# Altium schematic sheet MAIN.SchDoc
size 420 x 297 mm; Address1: Address1; Address2: Address2; Address3: Address3; Address4: Address4; SheetNumber: 1; SheetTotal: 2; Разраб.: Шкляев; Обозначение документа: ВРГД.468332.001 Э3; Пров.: Абрамов; Н.контр.: Ермакова; Утв.: Солдатченков; Наименование организации: АО "Вектор развития"; Перв. применение: ВРГД.468332.001; Наименование изделия 1: Плата; Наименование изделия 2: Схема электрическая; Наименование изделия 3: принципиальная; Нач. отд.: Нач. отд.; Фамилия нач. отд.: Кононенко; Наименование изделия 4: КОСВТ-1
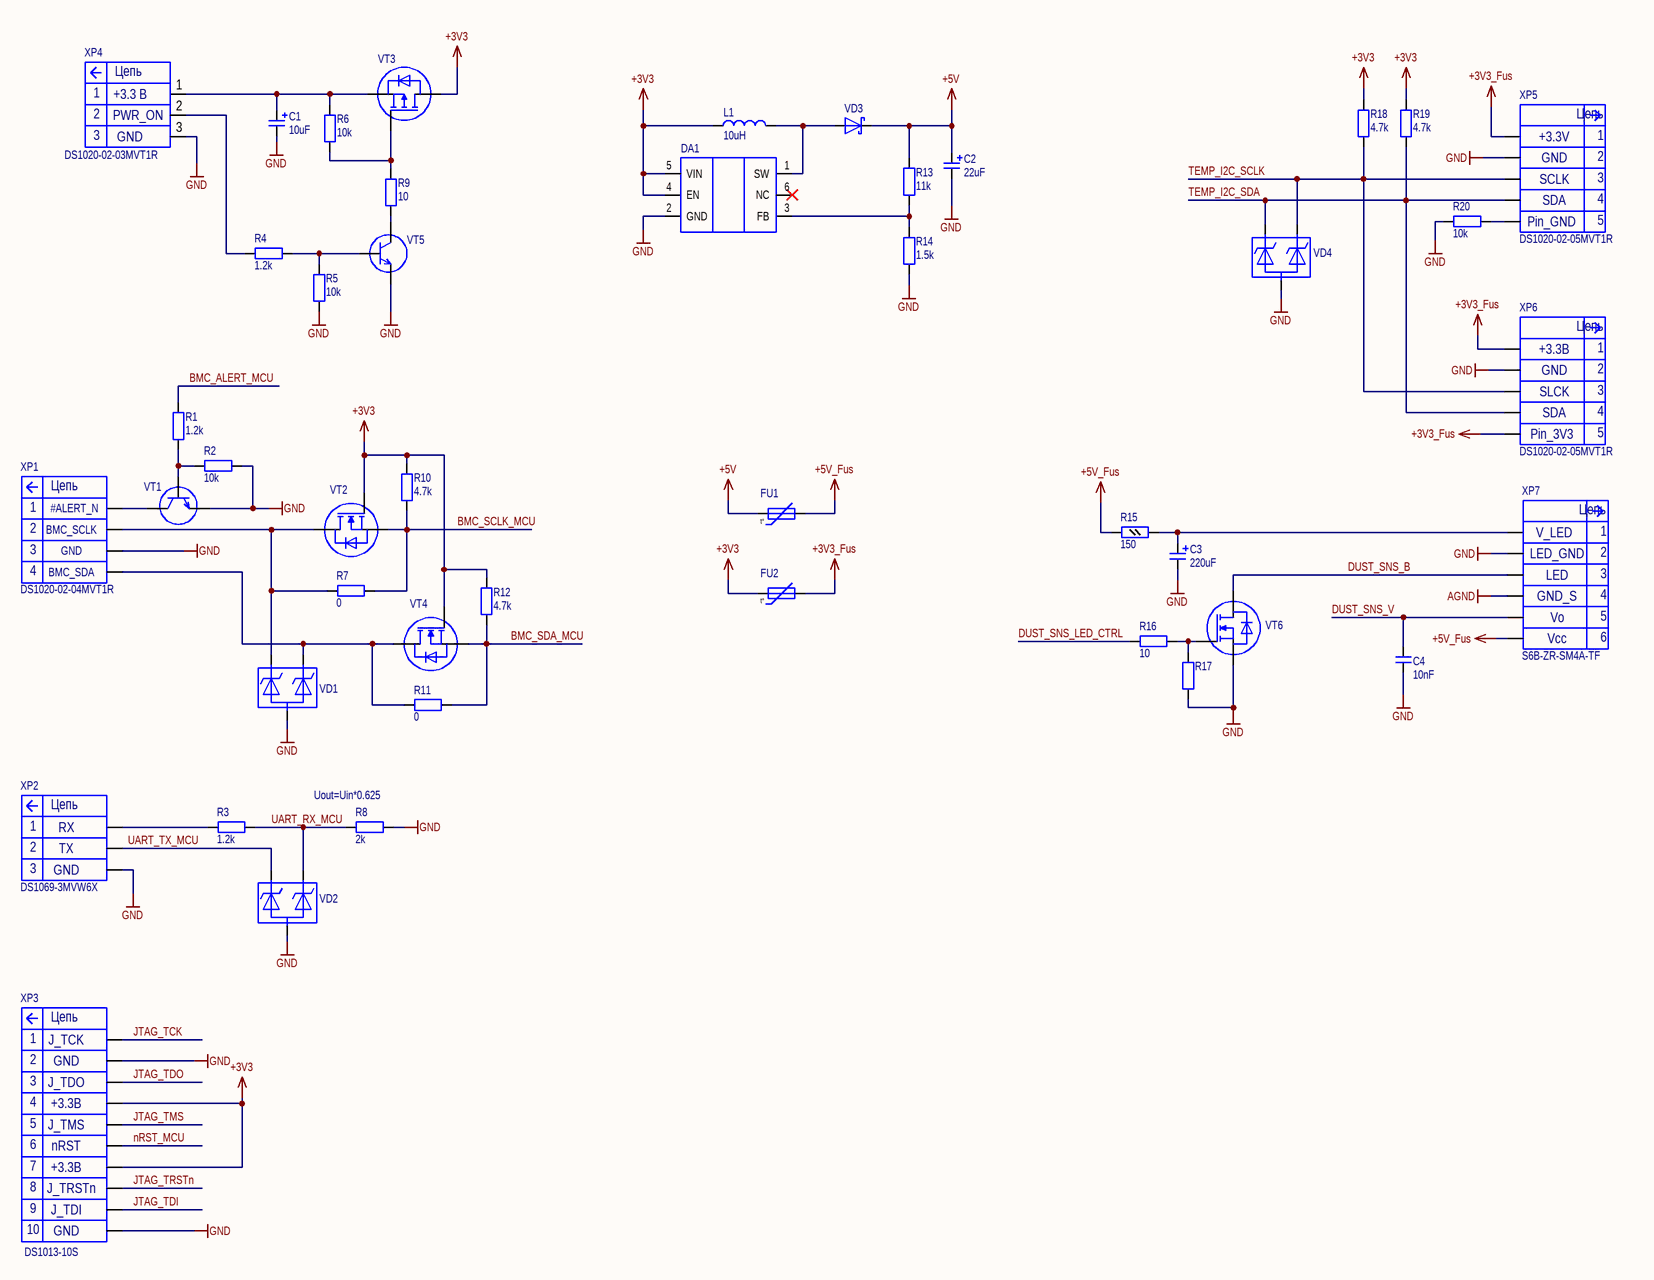
[diagram p0: MAIN.SchDoc]

## Parts
C1  10uF  [CAP ALSMD ELEC 4.3MM H5.4MM]
C2  22uF  [CAP ALSMD ELEC 4.3MM H5.4MM]
C3  220uF  [CAP ALSMD ELEC 6.6MM H7.7MM]
C4  10nF  [CAP 0603_1608]
DA1  MT3608 AEROSEMI  [TI SOT-23-6 DBV]  (value not drawn)
FU1  BSMD0603-010-15V BHFUSE  [FUSE 0603_1608 0.8MM]  (value not drawn)
FU2  BSMD0603-010-15V BHFUSE  [FUSE 0603_1608 0.8MM]  (value not drawn)
L1  10uH  [MURATA LQH32CN]
R1  1.2k  [RES 0603_1608]
R2  10k  [RES 0603_1608]
R3  1.2k  [RES 0603_1608]
R4  1.2k  [RES 0603_1608]
R5  10k  [RES 0603_1608]
R6  10k  [RES 0603_1608]
R7  0  [RES 0603_1608]
R8  2k  [RES 0603_1608]
R9  10  [RES 0603_1608]
R10  4.7k  [RES 0603_1608]
R11  0  [RES 0603_1608]
R12  4.7k  [RES 0603_1608]
R13  11k  [RES 0603_1608]
R14  1.5k  [RES 0603_1608]
R15  150  [RES 0805_2012]
R16  10  [RES 0603_1608]
R17  (no value)  [RES 0603_1608]
R18  4.7k  [RES 0603_1608]
R19  4.7k  [RES 0603_1608]
R20  10k  [RES 0603_1608]
VD1  PESD5V0U1UT  [SOT-23-3 N]  (value not drawn)
VD2  PESD5V0U1UT  [SOT-23-3 N]  (value not drawn)
VD3  1N5817WS Hottech  [MCC SOD-323]  (value not drawn)
VD4  PESD5V0U1UT  [SOT-23-3 N]  (value not drawn)
VT1  КТ229Б9  [SOT-23-3 N]  (value not drawn)
VT2  КП526А9  [SOT-23-3 N]  (value not drawn)
VT3  AO3401 Hottech  [SOT-23-3 N]  (value not drawn)
VT4  КП526А9  [SOT-23-3 N]  (value not drawn)
VT5  КТ229Б9  [SOT-23-3 N]  (value not drawn)
VT6  КП526А9  [SOT-23-3 N]  (value not drawn)
XP1  DS1020-02-04MVT1R  Net_4: BMC_SDA  Net_3: GND  Net_2: BMC_SCLK  Net_1: #ALERT_N  [DS1020-02-04MVT1R]
XP2  DS1069-3MVW6X  Net_3: GND  Net_1: RX  Net_2: TX  [CONNFLY_DS1069-3M]
XP3  DS1013-10S  Net_10: GND  Net_9: J_TDI  Net_8: J_TRSTn  Net_7: +3.3В  Net_6: nRST  Net_5: J_TMS  Net_3: J_TDO  Net_1: J_TCK  [DS1013-10S]
XP4  DS1020-02-03MVT1R  Net_3: GND  Net_1: +3.3 В  Net_2: PWR_ON  [DS1020-02-03MVT1R]
XP5  DS1020-02-05MVT1R  Net_5: Pin_GND  Net_4: SDA  Net_3: SCLK  Net_2: GND  Net_1: +3.3V  [DS1020-02-05MVT1R]
XP6  DS1020-02-05MVT1R  Net_5: Pin_3V3  Net_4: SDA  Net_3: SLCK  Net_2: GND  Net_1: +3.3В  [DS1020-02-05MVT1R]
XP7  S6B-ZR-SM4A-TF  Net_6: Vcc  Net_5: Vo  Net_4: GND_S  Net_3: LED  Net_2: LED_GND  Net_1: V_LED  [JST S6B-ZR-SM4A-TF]

## Nets
+3V3: DA1.4(EN) DA1.5(VIN) FU2.1 L1.1(P) R10.2 R12.2 R18.2 R19.2 VT2.1(G) VT3.3(D) VT4.1(G) XP3.4 XP3.7
+3V3_Fus: FU2.2 XP5.1 XP6.1 XP6.5
+5V: C2.1(P) FU1.1 R13.2 VD3.2(C)
+5V_Fus: FU1.2 R15.1 XP7.6
AGND: XP7.4
GND: C1.2(N) C2.2(N) C3.2(N) C4.1 DA1.2(GND) R2.1 R5.1 R8.2 R14.1 R17.1 R20.2 VD1.3(A) VD2.3(A) VD4.3(A) VT1.2(E) VT5.2(E) VT6.2(S) XP1.3 XP2.3 XP3.2 XP3.10 XP4.3 XP5.2 XP6.2 XP7.2
BMC_ALERT_MCU: R1.2
BMC_SCLK_MCU: R7.1 R10.1 VT2.2(S)
BMC_SDA_MCU: R11.1 R12.1 VT4.2(S)
DUST_SNS_B: VT6.3(D) XP7.3
DUST_SNS_LED_CTRL: R16.1
DUST_SNS_V: C4.2 XP7.5
JTAG_TCK: XP3.1
JTAG_TDI: XP3.9
JTAG_TDO: XP3.3
JTAG_TMS: XP3.5
JTAG_TRSTn: XP3.8
nRST_MCU: XP3.6
TEMP_I2C_SCLK: R18.1 VD4.2(C2) XP5.3 XP6.3
TEMP_I2C_SDA: R19.1 VD4.1(C1) XP5.4 XP6.4
UART_RX_MCU: R3.2 R8.1 VD2.2(C2)
UART_TX_MCU: VD2.1(C1) XP2.2
NetC1_1: C1.1(P) R6.2 VT3.2(S) XP4.1
NetC3_1: C3.1(P) R15.2 XP7.1
NetDA1_1: DA1.1(SW) L1.2(N) VD3.1(A)
NetDA1_3: DA1.3(FB) R13.1 R14.2
NetR1_1: R1.1 R2.2 VT1.1(B)
NetR3_1: R3.1 XP2.1
NetR4_1: R4.1 XP4.2
NetR4_2: R4.2 R5.2 VT5.1(B)
NetR6_1: R6.1 R9.1 VT3.1(G)
NetR7_2: R7.2 VD1.1(C1) VT2.3(D) XP1.2
NetR9_2: R9.2 VT5.3(C)
NetR11_2: R11.2 VD1.2(C2) VT4.3(D) XP1.4
NetR16_2: R16.2 R17.2 VT6.1(G)
NetR20_1: R20.1 XP5.5
NetVT1_3: VT1.3(C) XP1.1

Not connected (* = marked no-connect by the designer): DA1 6(NC)*

## Notes on the sheet
- (near R8) Uout=Uin*0.625
- Перв. примен.
- Справ. №
- Подп. и дата
- Инв. № дубл.
- Взам. инв. №
- Разраб.
- Изм.
- Лист
- № докум.
- Подп.
- Дата
- Лит.
- Масса
- Масштаб
- Пров.
- Листов
- Инв. № подл.
- Утв.
- Н.контр.
- Копировал
- Формат А3
- (in symbol BSMD0603-010-15V BHFUSE) t°
- (in symbol DS1013-10S) Цепь
- (in symbol DS1020-02-03MVT1R) Цепь
- (in symbol DS1020-02-04MVT1R) Цепь
- (in symbol DS1020-02-05MVT1R) Цепь
- (in symbol DS1069-3MVW6X) Цепь
- (in symbol S6B-ZR-SM4A-TF) Цепь

## Library data of the parts
C1 = К50-97 – 25В – 10мкФ (±20) % – ЕВАЯ.673541.054ТУ: Конденсатор К50-97 – 25В – 10мкФ (±20) % – ЕВАЯ.673541.054ТУ; Manufacturer: АО Элеконд; Group: Конденсаторы полярные; Type: Конденсатор электролитический; Tolerance: ± 20%; Dielectric type: Electrolytic; Voltage: 25V; Manufacturer Part Number: К50-97 – 25В – 10мкФ (±20) % – ЕВАЯ.673541.054ТУ; Name: К50-97 – 25В – 10мкФ (±20) % – ЕВАЯ.673541.054ТУ; Value: 10uF; Country: Россия; Package: SMD D4x5.4; HelpURL: https://elecond.ru/pdf/k50-97.pdf
C2 = К50-97 – 16В – 22мкФ (±20) % – ЕВАЯ.673541.054ТУ: Конденсатор К50-97 – 16В – 22мкФ (±20) % – ЕВАЯ.673541.054ТУ; Manufacturer: АО Элеконд; Group: Конденсаторы полярные; Type: Конденсатор электролитический; Tolerance: ± 20%; Dielectric type: Electrolytic; Voltage: 16V; Manufacturer Part Number: К50-97 – 16В – 22мкФ (±20) % – ЕВАЯ.673541.054ТУ; Name: К50-97 – 16В – 22мкФ (±20) % – ЕВАЯ.673541.054ТУ; Value: 22uF; Country: Россия; Package: SMD D4x5.4; HelpURL: https://elecond.ru/pdf/k50-97.pdf
C3 = К50-97 – 16В – 220мкФ (±20) % – ЕВАЯ.673541.054ТУ: Конденсатор К50-97 – 16В – 220мкФ (±20) % – ЕВАЯ.673541.054ТУ; Manufacturer: АО Элеконд; Group: Конденсаторы полярные; Type: Конденсатор электролитический; Tolerance: ± 20%; Dielectric type: Electrolytic; Voltage: 16V; Manufacturer Part Number: К50-97 – 16В – 220мкФ (±20) % – ЕВАЯ.673541.054ТУ; Name: К50-97 – 16В – 220мкФ (±20) % – ЕВАЯ.673541.054ТУ; Value: 220uF; Country: Россия; Package: SMD D6.3x7.7; HelpURL: https://elecond.ru/pdf/k50-97.pdf
C4 = GRM188R71E103K: Конденсатор 0603-X7R-25В-10мкФ ± 10%; Manufacturer: Murata Electronics; Group: Конденсаторы; Type: Конденсатор керамический; Dielectric type: X7R; Voltage: 25V; Manufacturer Part Number: GRM188R71E103K; Name: GRM188R71E103K; Value: 10nF; Tolerance: ± 10%; Country: Япония; Package: SMD0603
DA1 = MT3608 AEROSEMI: Микросхема MT3608; Group: Микросхемы; Input Voltage: 2V to 24V; Output Voltage: Up to 28V; Max Temperature: 150°С; Min Temperature: -40°С; Manufacturer Part Number: MT3608 AEROSEMI; Type: Импульсный повышающий преобразователь; Name: MT3608; Country: Китай; Manufacturer: AEROSEMI; Package: SOT23-6
FU1 FU2 = BSMD0603-010-15V BHFUSE: Предохранитель самовосстанавливающийся BSMD0603-010-15V; Group: Предохранители; I hold: 0.1A; I trip: 0.3A; V: 15V; Manufacturer Part Number: BSMD0603-010-15V BHFUSE; Type: Предохранитель самовосстанавливающийся; Name: BSMD0603-010-15V; Country: Китай; Manufacturer: BHFUSE; Package: SMD0603; HelpURL: https://static.chipdip.ru/lib/966/DOC042966016.pdf
L1 = LQH32CN100K33L: Индуктивность 1210-0,45A-10мкГ ± 10%; Manufacturer: Murata Electronics; Group: Индуктивности; Current: 450mA; Rdc: 0.3Ohm; SRfreq: 26MHz; Manufacturer Part Number: LQH32CN100K33L; Type: Индуктивности; Name: LQH32CN100K33L; Value: 10uH; Tolerance: ± 10%; Country: Япония; Package: SMD1206
R1 R3 R4 = Р1-12 - 0,1 - 1,2кОм ±1%: Резистор Р1-12 - 0,1 - 1,2кОм ±1%; Manufacturer: АО «Ресурс»; Group: Резисторы; Power: 0.1W; Voltage: 50V; Manufacturer Part Number: Р1-12 - 0,1 - 1,2кОм ±1%; Type: Резистор; Name: Р1-12 - 0,1 - 1,2кОм ±1%; Value: 1.2k; Tolerance: ± 1%; Country: Россия; Package: SMD0603; HelpURL: https://aoresurs.com/upload/iblock/4b6/hnw668dxbiwjyxv0ejq9urcu5m58703r/Datasheet-R1_12-SHKAB.434110.024TU.pdf
R2 R5 R6 R20 = Р1-12 - 0,1 - 10кОм ±1%: Резистор Р1-12 - 0,1 - 10кОм ±1%; Manufacturer: АО «Ресурс»; Group: Резисторы; Power: 0.1W; Voltage: 50V; Manufacturer Part Number: Р1-12 - 0,1 - 10кОм ±1%; Type: Резистор; Name: Р1-12 - 0,1 - 10кОм ±1%; Value: 10k; Tolerance: ± 1%; Country: Россия; Package: SMD0603; HelpURL: https://aoresurs.com/upload/iblock/4b6/hnw668dxbiwjyxv0ejq9urcu5m58703r/Datasheet-R1_12-SHKAB.434110.024TU.pdf
R7 R11 = Р1-12 - 0603 - 0,05: Перемычка Р1-12 - 0603 - 0,05; Manufacturer: АО «Ресурс»; Group: Резисторы; Power: 3A; Manufacturer Part Number: Р1-12 - 0603 - 0,05; Type: Перемычка; Name: Р1-12 - 0603 - 0,05; Value: 0; Country: Россия; Package: SMD0603; HelpURL: https://aoresurs.com/upload/iblock/b10/xo9xl0w0128k43psd6nz5q3kfcc2cprs/peremychka-R1_12-SHKAB.434110.025TU.pdf
R8 = Р1-12 - 0,1 - 2кОм ±1%: Резистор Р1-12 - 0,1 - 2кОм ±1%; Manufacturer: АО «Ресурс»; Group: Резисторы; Power: 0.1W; Voltage: 50V; Manufacturer Part Number: Р1-12 - 0,1 - 2кОм ±1%; Type: Резистор; Name: Р1-12 - 0,1 - 2кОм ±1%; Value: 2k; Tolerance: ± 1%; Country: Россия; Package: SMD0603; HelpURL: https://aoresurs.com/upload/iblock/4b6/hnw668dxbiwjyxv0ejq9urcu5m58703r/Datasheet-R1_12-SHKAB.434110.024TU.pdf
R9 R16 = Р1-12 - 0,1 - 10Ом ±1%: Резистор Р1-12 - 0,1 - 10Ом ±1%; Manufacturer: АО «Ресурс»; Group: Резисторы; Power: 0.1W; Voltage: 50V; Manufacturer Part Number: Р1-12 - 0,1 - 10Ом ±1%; Type: Резистор; Name: Р1-12 - 0,1 - 10Ом ±1%; Value: 10; Tolerance: ± 1%; Country: Россия; Package: SMD0603; HelpURL: https://aoresurs.com/upload/iblock/4b6/hnw668dxbiwjyxv0ejq9urcu5m58703r/Datasheet-R1_12-SHKAB.434110.024TU.pdf
R10 R12 R18 R19 = Р1-12 - 0,1 - 4,7кОм ±1%: Резистор Р1-12 - 0,1 - 4,7кОм ±1%; Manufacturer: АО «Ресурс»; Group: Резисторы; Power: 0.1W; Voltage: 50V; Manufacturer Part Number: Р1-12 - 0,1 - 4,7кОм ±1%; Type: Резистор; Name: Р1-12 - 0,1 - 4,7кОм ±1%; Value: 4.7k; Tolerance: ± 1%; Country: Россия; Package: SMD0603; HelpURL: https://aoresurs.com/upload/iblock/4b6/hnw668dxbiwjyxv0ejq9urcu5m58703r/Datasheet-R1_12-SHKAB.434110.024TU.pdf
R13 = Р1-12 - 0,1 - 11кОм ±1%: Резистор Р1-12 - 0,1 - 11кОм ±1%; Manufacturer: АО «Ресурс»; Group: Резисторы; Power: 0.1W; Voltage: 50V; Manufacturer Part Number: Р1-12 - 0,1 - 11кОм ±1%; Type: Резистор; Name: Р1-12 - 0,1 - 11кОм ±1%; Value: 11k; Tolerance: ± 1%; Country: Россия; Package: SMD0603; HelpURL: https://aoresurs.com/upload/iblock/4b6/hnw668dxbiwjyxv0ejq9urcu5m58703r/Datasheet-R1_12-SHKAB.434110.024TU.pdf
R14 = Р1-12 - 0,1 - 1,5кОм ±1%: Резистор Р1-12 - 0,1 - 1,5кОм ±1%; Manufacturer: АО «Ресурс»; Group: Резисторы; Power: 0.1W; Voltage: 50V; Manufacturer Part Number: Р1-12 - 0,1 - 1,5кОм ±1%; Type: Резистор; Name: Р1-12 - 0,1 - 1,5кОм ±1%; Value: 1.5k; Tolerance: ± 1%; Country: Россия; Package: SMD0603; HelpURL: https://aoresurs.com/upload/iblock/4b6/hnw668dxbiwjyxv0ejq9urcu5m58703r/Datasheet-R1_12-SHKAB.434110.024TU.pdf
R15 = Р1-12 - 0,125 - 150Ом ±1%: Резистор Р1-12 - 0,125 - 150Ом ±1%; Manufacturer: АО «Ресурс»; Group: Резисторы; Power: 0.125W; Voltage: 150V; Manufacturer Part Number: Р1-12 - 0,125 - 150Ом ±1%; Type: Резистор; Name: Р1-12 - 0,125 - 150Ом ±1%; Value: 150; Tolerance: ± 1%; Country: Россия; Package: SMD0805; HelpURL: https://aoresurs.com/upload/iblock/4b6/hnw668dxbiwjyxv0ejq9urcu5m58703r/Datasheet-R1_12-SHKAB.434110.024TU.pdf
R17 = Р1-12 - 0,1 - 10кОм ±1%: Резистор Р1-12 - 0,1 - 10кОм ±1%; Manufacturer: АО «Ресурс»; Group: Резисторы; Value: 10k; Power: 0.1W; Voltage: 50V; Manufacturer Part Number: Р1-12 - 0,1 - 10кОм ±1%; Type: Резистор; Name: Р1-12 - 0,1 - 10кОм ±1%; Tolerance: ± 1%; Country: Россия; Package: SMD0603; HelpURL: https://aoresurs.com/upload/iblock/4b6/hnw668dxbiwjyxv0ejq9urcu5m58703r/Datasheet-R1_12-SHKAB.434110.024TU.pdf
VD1 VD2 VD4 = PESD5V0U1UT: Диод ESD PESD5V0U1UT; Manufacturer: UTD Semiconductor; Group: Диоды; Type: Сборка ESD диодов; Vrwm: 5V; Manufacturer Part Number: PESD5V0U1UT; Package: SOT23-132; Name: PESD5V0U1UT; Country: Китай
VD3 = 1N5817WS Hottech: Диод Шоттки 1N5817WS; Group: Диоды; Max Vr: 20V; Max If: 1A; Manufacturer Part Number: 1N5817WS Hottech; Type: Диод Шоттки; Name: 1N5817WS; Country: Китай; Manufacturer: Hottech; Package: SOD-323
VT1 VT5 = КТ229Б9 АДКБ.432140.555 ТУ: Транзистор КТ229Б9 АДКБ.432140.555 ТУ; Manufacturer: Кремний Эл; Group: Транзисторы; Type: Транзистор биполярный; Struct: NPN; Vds/Vce: 45V; Id/Ic: 500mA; h21: 100-250; Manufacturer Part Number: КТ229Б9 АДКБ.432140.555 ТУ; Name: КТ229Б9; Country: Россия; Package: SOT-23-132; HelpURL: https://group-kremny.ru/upload/iblock/c8e/c8e3c704764e7e34f4ed87f6430e15b8.pdf
VT2 VT4 VT6 = КП526А9 АДКБ.432140.549 ТУ: Транзистор КП546А9 АДКБ.432140.549; Manufacturer: Кремний Эл; Group: Транзисторы; Type: Транзистор полевой; Struct: N-MOSFET; Vds/Vce: 30V; Id/Ic: 2; Vth: 1.45; Manufacturer Part Number: КП526А9 АДКБ.432140.549 ТУ; Name: КП526А9; Country: Россия; Package: SOT-23-132
VT3 = AO3401 Hottech: Транзистор  AO3401 Hottech; Group: Транзисторы; Type: Транзистор полевой; Struct: P-MOSFET; Vds/Vce: -30V; Id/Ic: -4A; Vth: -1.3V; Manufacturer Part Number: AO3401 Hottech; Name: AO3401; Country: Китай; Manufacturer: Hottech; Package: SOT-23-132; HelpURL: https://cdn.promelec.ru/upload/items/2023/12/08/AO3401%20SOT-23.pdf
XP1 = DS1020-02-04MVT1R: Соединитель DS1020-02-04MVT1R; Manufacturer: Connfly; Group: Соединители; Pins number: 4; Rows: 1; Nominal Voltage: 250V; Max Temperature: 105°С; Min Temperature: -40°С; Manufacturer Part Number: DS1020-02-04MVT1R; Type: Вилка угловая; Name: DS1020-02-04MVT1R; Country: Китай
XP2 = DS1069-3MVW6X: Соединитель DS1069-3MVW6X; Manufacturer: Connfly; Group: Соединители; Pins number: 3; Rows: 1; Nominal current: 3A; Nominal Voltage: 250V; Max Temperature: 85°С; Min Temperature: -25°С; Manufacturer Part Number: DS1069-3MVW6X; Type: Вилка прямая; Name: DS1069-3MVW6X; Country: Китай
XP3 = DS1013-10S: Соединитель DS1013-10S; Manufacturer: Connfly; Group: Соединители; Pins number: 10; Rows: 2; Nominal current: 1A; Nominal Voltage: 500V; Max Temperature: 105°С; Min Temperature: -40°С; Manufacturer Part Number: DS1013-10S; Type: Вилка прямая; Net_4: +3.3В; Net_2: GND; Name: DS1013-10S; Country: Китай
XP4 = DS1020-02-03MVT1R: Соединитель DS1020-02-03MVT1R; Manufacturer: Connfly; Group: Соединители; Pins number: 3; Rows: 1; Nominal Voltage: 250V; Max Temperature: 105°С; Min Temperature: -40°С; Manufacturer Part Number: DS1020-02-03MVT1R; Type: Вилка угловая; Name: DS1020-02-03MVT1R; Country: Китай
XP5 XP6 = DS1020-02-05MVT1R: Соединитель DS1020-02-05MVT1R; Manufacturer: Connfly; Group: Соединители; Pins number: 5; Rows: 1; Nominal Voltage: 250V; Max Temperature: 105°С; Min Temperature: -40°С; Manufacturer Part Number: DS1020-02-05MVT1R; Type: Вилка угловая; Name: DS1020-02-05MVT1R; Country: Китай
XP7 = S6B-ZR-SM4A-TF: Соединитель S6B-ZR-SM4A-TF; Manufacturer: JST; Group: Соединители; Pins number: 6; Rows: 1; Nominal current: 1A; Nominal Voltage: 50V; Max Temperature: 85°С; Min Temperature: -25°С; Manufacturer Part Number: S6B-ZR-SM4A-TF; Type: Вилка угловая; Name: S6B-ZR-SM4A-TF; Country: Япония